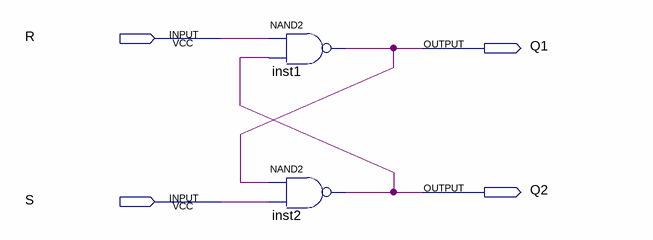
[diagram p0: schematic sheet]
// Quartus schematic latch_RS_nand.bdf as structural Verilog: 2 symbols, 4 pins
module latch_RS_nand (
  input  R,
  input  S,
  output Q1,
  output Q2
);

  nand inst1 (Q1, R, Q2);
  nand inst2 (Q2, Q1, S);
endmodule
